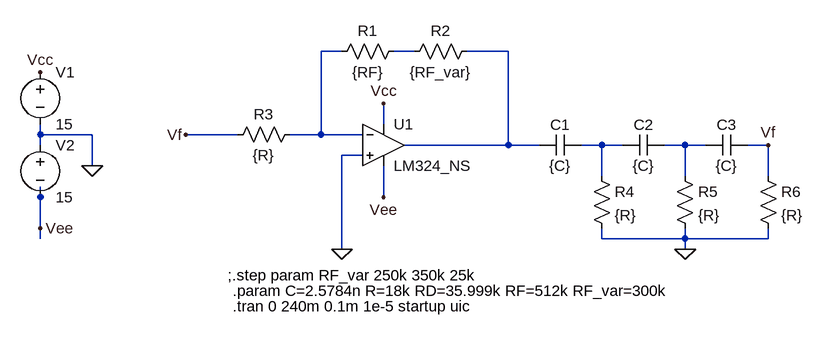
[diagram p0: schematic 1_teoretical_no_factor.asc]
1_teoretical_no_factor.asc, the LTspice schematic file:
Version 4
SHEET 1 904 680
WIRE 128 -32 96 -32
WIRE 240 -32 208 -32
WIRE 384 -32 320 -32
WIRE 192 80 192 48
WIRE -336 96 -336 80
WIRE -256 96 -336 96
WIRE -32 96 -112 96
WIRE 96 96 96 -32
WIRE 96 96 48 96
WIRE 160 96 96 96
WIRE -336 112 -336 96
WIRE 384 112 384 -32
WIRE 384 112 224 112
WIRE 432 112 384 112
WIRE 528 112 496 112
WIRE 560 112 528 112
WIRE 656 112 624 112
WIRE 688 112 656 112
WIRE 784 112 752 112
WIRE 160 128 128 128
WIRE -256 144 -256 96
WIRE 528 160 528 112
WIRE 656 160 656 112
WIRE 784 160 784 112
WIRE -336 192 -336 176
WIRE 192 192 192 144
WIRE -336 240 -336 192
WIRE -336 256 -336 240
WIRE 528 256 528 240
WIRE 656 256 656 240
WIRE 656 256 528 256
WIRE 784 256 784 240
WIRE 784 256 656 256
WIRE 128 272 128 128
WIRE 656 272 656 256
FLAG -336 0 Vcc
FLAG -336 240 Vee
FLAG -256 144 0
FLAG 128 272 0
FLAG 656 272 0
FLAG 784 112 Vf
FLAG -112 96 Vf
FLAG 192 192 Vee
FLAG 192 48 Vcc
SYMBOL res 224 -48 R90
WINDOW 0 0 56 VBottom 2
WINDOW 3 32 56 VTop 2
SYMATTR InstName R1
SYMATTR Value {RF}
SYMBOL res 336 -48 R90
WINDOW 0 0 56 VBottom 2
WINDOW 3 32 56 VTop 2
SYMATTR InstName R2
SYMATTR Value {RF_var}
SYMBOL voltage -336 -16 R0
WINDOW 123 0 0 Left 0
WINDOW 39 0 0 Left 0
SYMATTR InstName V1
SYMATTR Value 15
SYMBOL voltage -336 96 R0
WINDOW 123 0 0 Left 0
WINDOW 39 0 0 Left 0
SYMATTR InstName V2
SYMATTR Value 15
SYMBOL res 64 80 R90
WINDOW 0 0 56 VBottom 2
WINDOW 3 32 56 VTop 2
SYMATTR InstName R3
SYMATTR Value {R}
SYMBOL cap 496 96 R90
WINDOW 0 0 32 VBottom 2
WINDOW 3 32 32 VTop 2
SYMATTR InstName C1
SYMATTR Value {C}
SYMBOL cap 624 96 R90
WINDOW 0 0 32 VBottom 2
WINDOW 3 32 32 VTop 2
SYMATTR InstName C2
SYMATTR Value {C}
SYMBOL cap 752 96 R90
WINDOW 0 0 32 VBottom 2
WINDOW 3 32 32 VTop 2
SYMATTR InstName C3
SYMATTR Value {C}
SYMBOL res 512 144 R0
SYMATTR InstName R4
SYMATTR Value {R}
SYMBOL res 640 144 R0
SYMATTR InstName R5
SYMATTR Value {R}
SYMBOL res 768 144 R0
SYMATTR InstName R6
SYMATTR Value {R}
SYMBOL EXTRA\\ExtraOpamps\\LM324_NS 192 112 R0
SYMATTR InstName U1
TEXT -40 336 Left 2 !.param C=2.5784n R=18k RD=35.999k RF=512k RF_var=300k
TEXT -48 312 Left 2 !;.step param RF_var 250k 350k 25k
TEXT -40 360 Left 2 !.tran 0 240m 0.1m 1e-5 startup uic

The netlist it stands for:
* 1_teoretical_no_factor.asc
R1 N002 N001 {RF}
R2 N003 N002 {RF_var}
V1 Vcc 0 15
V2 0 Vee 15
R3 N001 Vf {R}
C1 N004 N003 {C}
C2 N005 N004 {C}
C3 Vf N005 {C}
R4 N004 0 {R}
R5 N005 0 {R}
R6 Vf 0 {R}
* U1: LM324_NS (symbol EXTRA\ExtraOpamps\LM324_NS not available, pins judged from their places): In+=0 In-=N001 V+=Vcc V-=Vee OUT=N003
.param C=2.5784n R=18k RD=35.999k RF=512k RF_var=300k
;.step param RF_var 250k 350k 25k
.tran 0 240m 0.1m 1e-5 startup uic
.backanno
.end